# Altium schematic sheet MCU.SchDoc: MCU.SchDoc
size 279 x 215 mm
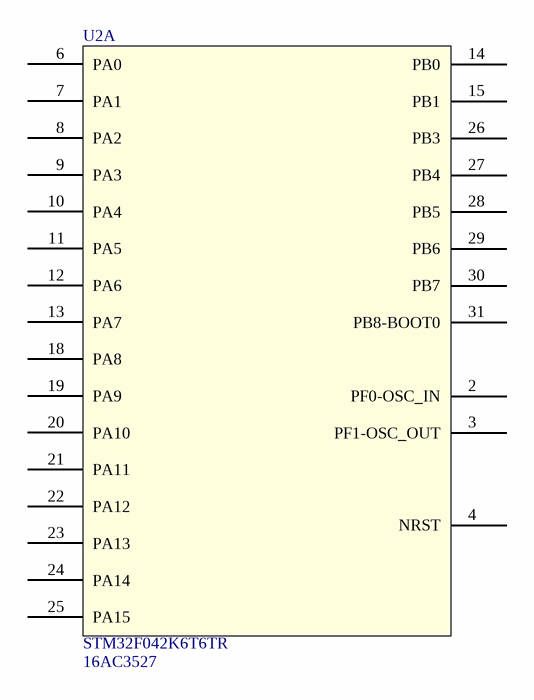
[diagram p0: MCU.SchDoc]

## Parts
U2  STM32F042K6T6TR  Supplier Part Number 1: 16AC3527  [LQFP-32]  (part A of 2)

## Nets

Not connected (* = marked no-connect by the designer): U2 2(PF0-OSC_IN) 3(PF1-OSC_OUT) 4(NRST) 6(PA0) 7(PA1) 8(PA2) 9(PA3) 10(PA4) 11(PA5) 12(PA6) 13(PA7) 14(PB0) 15(PB1) 18(PA8) 19(PA9) 20(PA10) 21(PA11) 22(PA12) 23(PA13) 24(PA14) 25(PA15) 26(PB3) 27(PB4) 28(PB5) 29(PB6) 30(PB7) 31(PB8-BOOT0)

## Notes on the sheet
- University of Waterloo Robotics Team
- 200 University Ave W
- REV
- PROJECT
- Waterloo, Ontario, Canada
- N2L 3G1
- DOCUMENT
- ENGINEER
- REVIEWER
- MODIFIED
- SHEET
- OF

## Library data of the parts
U2 = STM32F042K6T6TR: ARM® Cortex®-M0 STM32F0 Microcontroller IC 32-Bit Single-Core 48MHz 32KB (32K x 8) FLASH 32-LQFP (7x7); Mfr_Name: STMicroelectronics; Voltage - Supply (Vcc/Vdd): 2V ~ 3.6V; Core Processor: ARM® Cortex®-M0; Core Size: 32-Bit Single-Core; Speed: 48MHz; Program Memory Size: 32KB (32K x 8); Operating Temperature: -40°C ~ 85°C (TA); Package / Case: 32-LQFP; ComponentLink1Description: digikey; ComponentLink1URL: https://www.digikey.com/en/products/detail/stmicroelectronics/STM32F042K6T6TR/10414582; Supplier 1: Avnet